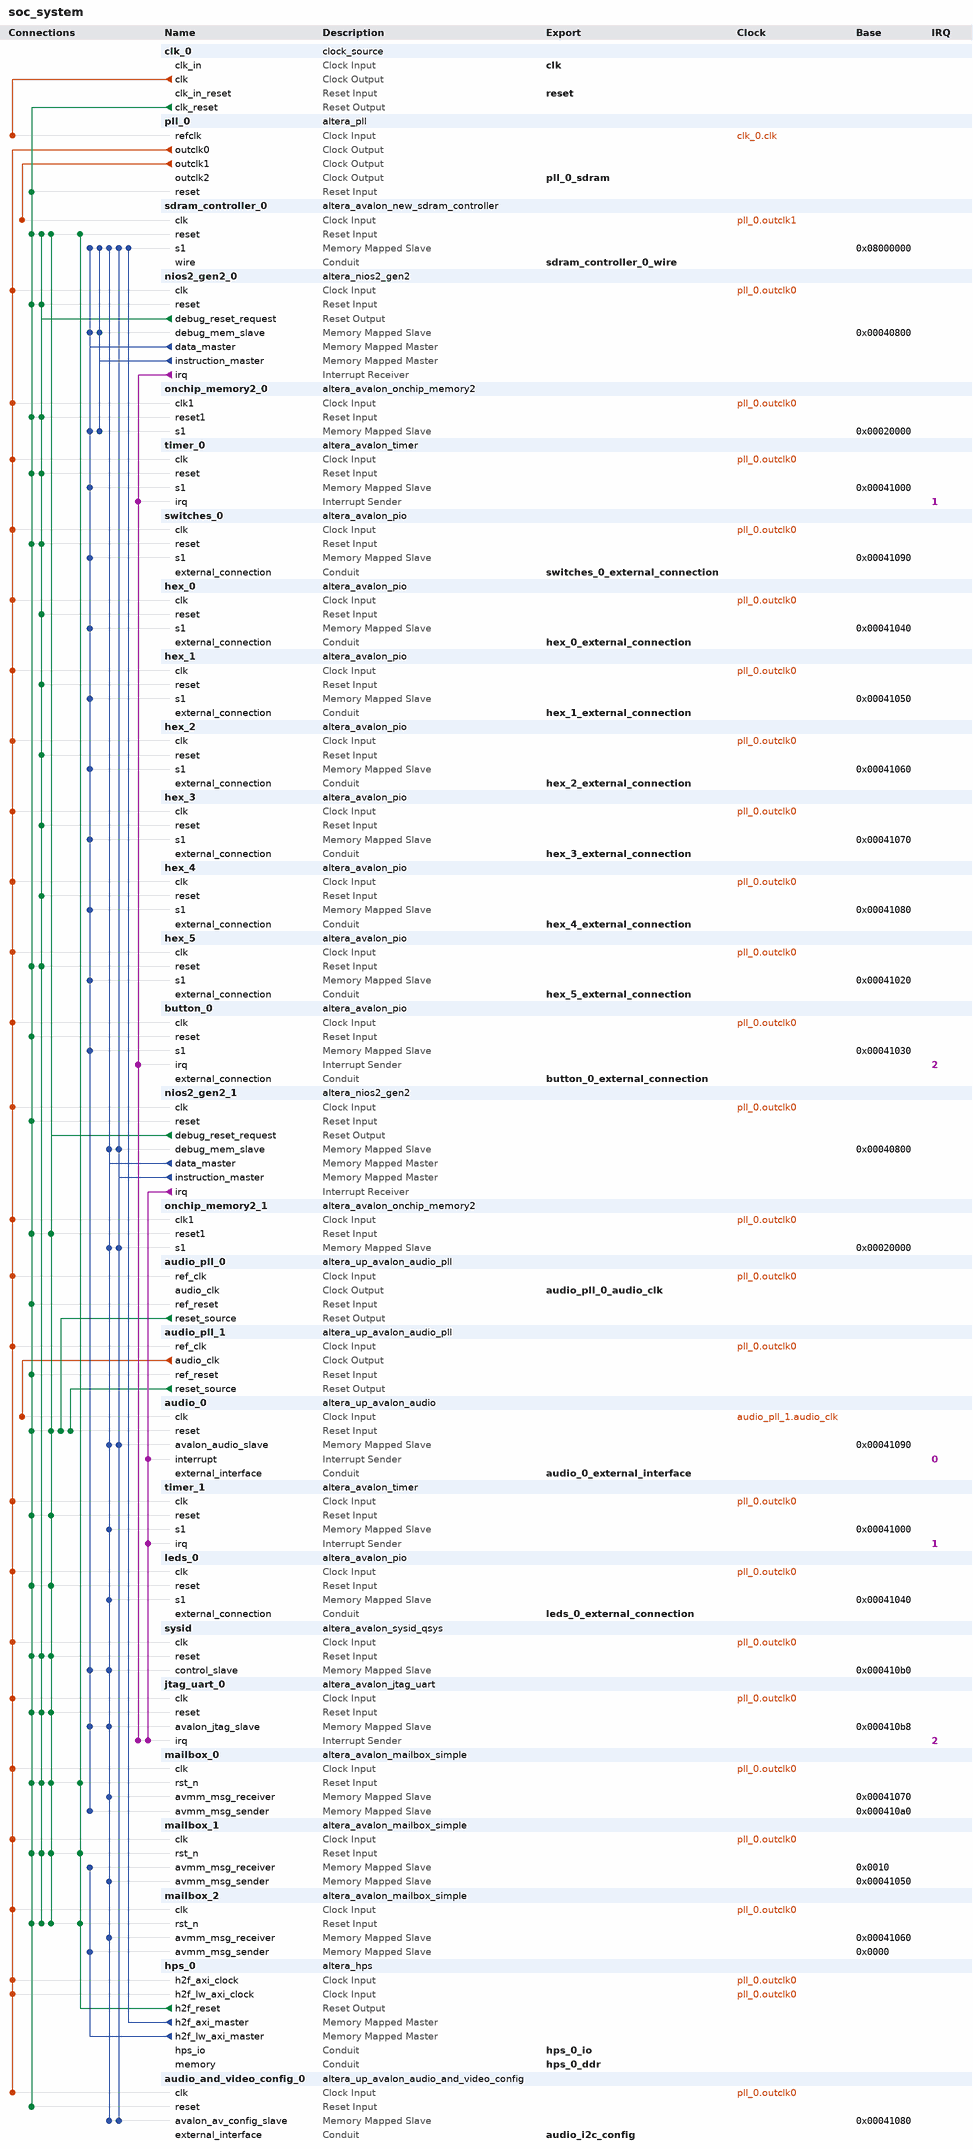
[diagram p0: system contents]
# Platform Designer (Qsys) system soc_system, Cyclone V 5CSEMA5F31C6
# Parameters at their usual value, and those the tool derives, are not listed.
package require -exact qsys 20.1
create_system soc_system
set_project_property DEVICE_FAMILY {Cyclone V}
set_project_property DEVICE 5CSEMA5F31C6

add_instance clk_0 clock_source 20.1
set_instance_parameter_value clk_0 clockFrequency 50000000

add_instance pll_0 altera_pll 20.1
set_instance_parameter_value pll_0 gui_device_speed_grade 1
set_instance_parameter_value pll_0 gui_number_of_clocks 3
set_instance_parameter_value pll_0 gui_operation_mode normal
set_instance_parameter_value pll_0 gui_output_clock_frequency0 50.0
set_instance_parameter_value pll_0 gui_output_clock_frequency1 100.0
set_instance_parameter_value pll_0 gui_output_clock_frequency2 100.0
set_instance_parameter_value pll_0 gui_phase_shift2 -3758
set_instance_parameter_value pll_0 gui_pll_mode {Integer-N PLL}
set_instance_parameter_value pll_0 gui_reference_clock_frequency 50.0
set_instance_parameter_value pll_0 gui_use_locked false

add_instance sdram_controller_0 altera_avalon_new_sdram_controller 20.1
set_instance_parameter_value sdram_controller_0 TAC 5.4
set_instance_parameter_value sdram_controller_0 TRCD 15.0
set_instance_parameter_value sdram_controller_0 TRP 15.0
set_instance_parameter_value sdram_controller_0 casLatency 3
set_instance_parameter_value sdram_controller_0 columnWidth 10
set_instance_parameter_value sdram_controller_0 dataWidth 16
set_instance_parameter_value sdram_controller_0 generateSimulationModel false
set_instance_parameter_value sdram_controller_0 model single_Micron_MT48LC4M32B2_7_chip
set_instance_parameter_value sdram_controller_0 numberOfBanks 4
set_instance_parameter_value sdram_controller_0 numberOfChipSelects 1
set_instance_parameter_value sdram_controller_0 powerUpDelay 100.0
set_instance_parameter_value sdram_controller_0 refreshPeriod 7.8125
set_instance_parameter_value sdram_controller_0 rowWidth 13

add_instance nios2_gen2_0 altera_nios2_gen2 20.1
set_instance_parameter_value nios2_gen2_0 dcache_size 2048
set_instance_parameter_value nios2_gen2_0 exceptionSlave sdram_controller_0.s1
set_instance_parameter_value nios2_gen2_0 icache_size 4096
set_instance_parameter_value nios2_gen2_0 impl Tiny
set_instance_parameter_value nios2_gen2_0 resetSlave onchip_memory2_0.s1

add_instance onchip_memory2_0 altera_avalon_onchip_memory2 20.1
set_instance_parameter_value onchip_memory2_0 dataWidth 256
set_instance_parameter_value onchip_memory2_0 dualPort false
set_instance_parameter_value onchip_memory2_0 initMemContent true
set_instance_parameter_value onchip_memory2_0 initializationFileName D:/Fax/projektovanje_namjenskih_racunarski_struktura/pnrs-2023/de1-soc-audio/sw/nios/app_0/de1_soc_user_input/mem_init/user_input_init.hex
set_instance_parameter_value onchip_memory2_0 memorySize 128000
set_instance_parameter_value onchip_memory2_0 useNonDefaultInitFile true
set_instance_parameter_value onchip_memory2_0 writable false

add_instance timer_0 altera_avalon_timer 20.1
set_instance_parameter_value timer_0 period 1
set_instance_parameter_value timer_0 periodUnits MSEC

add_instance switches_0 altera_avalon_pio 20.1
set_instance_parameter_value switches_0 direction Input
set_instance_parameter_value switches_0 width 10

add_instance hex_0 altera_avalon_pio 20.1
set_instance_parameter_value hex_0 direction Output
set_instance_parameter_value hex_0 resetValue 127
set_instance_parameter_value hex_0 width 7

add_instance hex_1 altera_avalon_pio 20.1
set_instance_parameter_value hex_1 direction Output
set_instance_parameter_value hex_1 resetValue 127
set_instance_parameter_value hex_1 width 7

add_instance hex_2 altera_avalon_pio 20.1
set_instance_parameter_value hex_2 direction Output
set_instance_parameter_value hex_2 resetValue 127
set_instance_parameter_value hex_2 width 7

add_instance hex_3 altera_avalon_pio 20.1
set_instance_parameter_value hex_3 direction Output
set_instance_parameter_value hex_3 resetValue 127
set_instance_parameter_value hex_3 width 7

add_instance hex_4 altera_avalon_pio 20.1
set_instance_parameter_value hex_4 direction Output
set_instance_parameter_value hex_4 resetValue 127
set_instance_parameter_value hex_4 width 7

add_instance hex_5 altera_avalon_pio 20.1
set_instance_parameter_value hex_5 direction Output
set_instance_parameter_value hex_5 resetValue 127
set_instance_parameter_value hex_5 width 7

add_instance button_0 altera_avalon_pio 20.1
set_instance_parameter_value button_0 captureEdge true
set_instance_parameter_value button_0 direction Input
set_instance_parameter_value button_0 edgeType FALLING
set_instance_parameter_value button_0 generateIRQ true
set_instance_parameter_value button_0 irqType EDGE
set_instance_parameter_value button_0 width 4

add_instance nios2_gen2_1 altera_nios2_gen2 20.1
set_instance_parameter_value nios2_gen2_1 cpuID 1
set_instance_parameter_value nios2_gen2_1 dcache_size 2048
set_instance_parameter_value nios2_gen2_1 exceptionOffset 1048608
set_instance_parameter_value nios2_gen2_1 exceptionSlave sdram_controller_0.s1
set_instance_parameter_value nios2_gen2_1 icache_size 4096
set_instance_parameter_value nios2_gen2_1 impl Tiny
set_instance_parameter_value nios2_gen2_1 resetSlave onchip_memory2_1.s1

add_instance onchip_memory2_1 altera_avalon_onchip_memory2 20.1
set_instance_parameter_value onchip_memory2_1 dataWidth 256
set_instance_parameter_value onchip_memory2_1 dualPort false
set_instance_parameter_value onchip_memory2_1 initMemContent true
set_instance_parameter_value onchip_memory2_1 initializationFileName D:/Fax/projektovanje_namjenskih_racunarski_struktura/pnrs-2023/de1-soc-audio/sw/nios/app_1/de1_soc_audio_processing/mem_init/audio_processing_init.hex
set_instance_parameter_value onchip_memory2_1 memorySize 128000
set_instance_parameter_value onchip_memory2_1 useNonDefaultInitFile true
set_instance_parameter_value onchip_memory2_1 writable false

add_instance audio_pll_0 altera_up_avalon_audio_pll 18.0
set_instance_parameter_value audio_pll_0 audio_clk_freq 18.432
set_instance_parameter_value audio_pll_0 gui_refclk 50.0

add_instance audio_pll_1 altera_up_avalon_audio_pll 18.0
set_instance_parameter_value audio_pll_1 audio_clk_freq 18.432
set_instance_parameter_value audio_pll_1 gui_refclk 50.0

add_instance audio_0 altera_up_avalon_audio 18.0
set_instance_parameter_value audio_0 audio_in true
set_instance_parameter_value audio_0 avalon_bus_type {Memory Mapped}
set_instance_parameter_value audio_0 dw 24

add_instance timer_1 altera_avalon_timer 20.1
set_instance_parameter_value timer_1 period 1
set_instance_parameter_value timer_1 periodUnits MSEC

add_instance leds_0 altera_avalon_pio 20.1
set_instance_parameter_value leds_0 direction Output
set_instance_parameter_value leds_0 width 10

add_instance sysid altera_avalon_sysid_qsys 20.1
set_instance_parameter_value sysid id 0

add_instance jtag_uart_0 altera_avalon_jtag_uart 20.1
set_instance_parameter_value jtag_uart_0 simInteractiveOptions NO_INTERACTIVE_WINDOWS

add_instance mailbox_0 altera_avalon_mailbox_simple 20.1
set_instance_parameter_value mailbox_0 AWIDTH 2
set_instance_parameter_value mailbox_0 DWIDTH 32
set_instance_parameter_value mailbox_0 MSG_ARRIVAL_NOTIFY 0
set_instance_parameter_value mailbox_0 MSG_SPACE_NOTIFY 0

add_instance mailbox_1 altera_avalon_mailbox_simple 20.1
set_instance_parameter_value mailbox_1 AWIDTH 2
set_instance_parameter_value mailbox_1 DWIDTH 32
set_instance_parameter_value mailbox_1 MSG_ARRIVAL_NOTIFY 0
set_instance_parameter_value mailbox_1 MSG_SPACE_NOTIFY 0

add_instance mailbox_2 altera_avalon_mailbox_simple 20.1
set_instance_parameter_value mailbox_2 AWIDTH 2
set_instance_parameter_value mailbox_2 DWIDTH 32
set_instance_parameter_value mailbox_2 MSG_ARRIVAL_NOTIFY 0
set_instance_parameter_value mailbox_2 MSG_SPACE_NOTIFY 0

add_instance hps_0 altera_hps 20.1
set_instance_parameter_value hps_0 EMAC1_Mode RGMII
set_instance_parameter_value hps_0 EMAC1_PinMuxing {HPS I/O Set 0}
set_instance_parameter_value hps_0 F2SCLK_COLDRST_Enable false
set_instance_parameter_value hps_0 F2SCLK_DBGRST_Enable false
set_instance_parameter_value hps_0 F2SCLK_WARMRST_Enable false
set_instance_parameter_value hps_0 F2SINTERRUPT_Enable false
set_instance_parameter_value hps_0 F2S_Width 0
set_instance_parameter_value hps_0 FPGA_PERIPHERAL_OUTPUT_CLOCK_FREQ_EMAC0_GTX_CLK 125
set_instance_parameter_value hps_0 FPGA_PERIPHERAL_OUTPUT_CLOCK_FREQ_EMAC0_MD_CLK 2.5
set_instance_parameter_value hps_0 FPGA_PERIPHERAL_OUTPUT_CLOCK_FREQ_EMAC1_GTX_CLK 125
set_instance_parameter_value hps_0 FPGA_PERIPHERAL_OUTPUT_CLOCK_FREQ_EMAC1_MD_CLK 2.5
set_instance_parameter_value hps_0 HPS_PROTOCOL DDR3
set_instance_parameter_value hps_0 I2C0_Mode I2C
set_instance_parameter_value hps_0 I2C0_PinMuxing {HPS I/O Set 0}
set_instance_parameter_value hps_0 I2C1_Mode N/A
set_instance_parameter_value hps_0 I2C1_PinMuxing Unused
set_instance_parameter_value hps_0 LWH2F_Enable true
set_instance_parameter_value hps_0 MEM_BANKADDR_WIDTH 3
set_instance_parameter_value hps_0 MEM_CLK_FREQ 400.0
set_instance_parameter_value hps_0 MEM_COL_ADDR_WIDTH 10
set_instance_parameter_value hps_0 MEM_DQ_WIDTH 32
set_instance_parameter_value hps_0 MEM_DRV_STR RZQ/7
set_instance_parameter_value hps_0 MEM_ROW_ADDR_WIDTH 15
set_instance_parameter_value hps_0 MEM_RTT_NOM RZQ/4
set_instance_parameter_value hps_0 MEM_RTT_WR RZQ/4
set_instance_parameter_value hps_0 MEM_TCL 11
set_instance_parameter_value hps_0 MEM_TFAW_NS 30.0
set_instance_parameter_value hps_0 MEM_TRAS_NS 35.0
set_instance_parameter_value hps_0 MEM_TRCD_NS 13.75
set_instance_parameter_value hps_0 MEM_TRFC_NS 260.0
set_instance_parameter_value hps_0 MEM_TRP_NS 13.75
set_instance_parameter_value hps_0 MEM_VENDOR Other
set_instance_parameter_value hps_0 MEM_WTCL 8
set_instance_parameter_value hps_0 QSPI_Mode N/A
set_instance_parameter_value hps_0 QSPI_PinMuxing Unused
set_instance_parameter_value hps_0 REF_CLK_FREQ 25.0
set_instance_parameter_value hps_0 S2FCLK_USER2CLK 5
set_instance_parameter_value hps_0 S2F_Width 1
set_instance_parameter_value hps_0 SDIO_Mode {4-bit Data}
set_instance_parameter_value hps_0 SDIO_PinMuxing {HPS I/O Set 0}
set_instance_parameter_value hps_0 SPIM1_Mode N/A
set_instance_parameter_value hps_0 SPIM1_PinMuxing Unused
set_instance_parameter_value hps_0 STM_Enable false
set_instance_parameter_value hps_0 TIMING_BOARD_AC_SKEW 0.02
set_instance_parameter_value hps_0 TIMING_BOARD_AC_TO_CK_SKEW 0.01
set_instance_parameter_value hps_0 TIMING_BOARD_DQ_TO_DQS_SKEW 0.05
set_instance_parameter_value hps_0 TIMING_BOARD_MAX_CK_DELAY 0.03
set_instance_parameter_value hps_0 TIMING_BOARD_MAX_DQS_DELAY 0.02
set_instance_parameter_value hps_0 TIMING_BOARD_SKEW_BETWEEN_DQS 0.06
set_instance_parameter_value hps_0 TIMING_BOARD_SKEW_CKDQS_DIMM_MAX 0.12
set_instance_parameter_value hps_0 TIMING_BOARD_SKEW_CKDQS_DIMM_MIN 0.06
set_instance_parameter_value hps_0 TIMING_BOARD_SKEW_WITHIN_DQS 0.01
set_instance_parameter_value hps_0 TIMING_TDH 65
set_instance_parameter_value hps_0 TIMING_TDQSCK 255
set_instance_parameter_value hps_0 TIMING_TDQSQ 125
set_instance_parameter_value hps_0 TIMING_TDS 30
set_instance_parameter_value hps_0 TIMING_TIH 140
set_instance_parameter_value hps_0 TIMING_TIS 180
set_instance_parameter_value hps_0 TIMING_TQSH 0.4
set_instance_parameter_value hps_0 UART0_Mode {No Flow Control}
set_instance_parameter_value hps_0 UART0_PinMuxing {HPS I/O Set 0}
set_instance_parameter_value hps_0 USB1_Mode N/A
set_instance_parameter_value hps_0 USB1_PinMuxing Unused
set_instance_parameter_value hps_0 desired_cfg_clk_mhz 100.0
set_instance_parameter_value hps_0 desired_qspi_clk_mhz 400.0

add_instance audio_and_video_config_0 altera_up_avalon_audio_and_video_config 18.0
set_instance_parameter_value audio_and_video_config_0 audio_in {Microphone to ADC}
set_instance_parameter_value audio_and_video_config_0 bit_length 24
set_instance_parameter_value audio_and_video_config_0 board DE1-SoC
set_instance_parameter_value audio_and_video_config_0 data_format {I2S Format}
set_instance_parameter_value audio_and_video_config_0 line_in_bypass false
set_instance_parameter_value audio_and_video_config_0 sampling_rate {48 kHz}

# connections
add_connection audio_pll_1.audio_clk audio_0.clk clock
add_connection clk_0.clk pll_0.refclk clock
add_connection pll_0.outclk0 audio_and_video_config_0.clk clock
add_connection pll_0.outclk0 audio_pll_0.ref_clk clock
add_connection pll_0.outclk0 audio_pll_1.ref_clk clock
add_connection pll_0.outclk0 button_0.clk clock
add_connection pll_0.outclk0 hex_0.clk clock
add_connection pll_0.outclk0 hex_1.clk clock
add_connection pll_0.outclk0 hex_2.clk clock
add_connection pll_0.outclk0 hex_3.clk clock
add_connection pll_0.outclk0 hex_4.clk clock
add_connection pll_0.outclk0 hex_5.clk clock
add_connection pll_0.outclk0 hps_0.h2f_axi_clock clock
add_connection pll_0.outclk0 hps_0.h2f_lw_axi_clock clock
add_connection pll_0.outclk0 jtag_uart_0.clk clock
add_connection pll_0.outclk0 leds_0.clk clock
add_connection pll_0.outclk0 mailbox_0.clk clock
add_connection pll_0.outclk0 mailbox_1.clk clock
add_connection pll_0.outclk0 mailbox_2.clk clock
add_connection pll_0.outclk0 nios2_gen2_0.clk clock
add_connection pll_0.outclk0 nios2_gen2_1.clk clock
add_connection pll_0.outclk0 onchip_memory2_0.clk1 clock
add_connection pll_0.outclk0 onchip_memory2_1.clk1 clock
add_connection pll_0.outclk0 switches_0.clk clock
add_connection pll_0.outclk0 sysid.clk clock
add_connection pll_0.outclk0 timer_0.clk clock
add_connection pll_0.outclk0 timer_1.clk clock
add_connection pll_0.outclk1 sdram_controller_0.clk clock
add_connection audio_pll_0.reset_source audio_0.reset reset
add_connection audio_pll_1.reset_source audio_0.reset reset
add_connection clk_0.clk_reset audio_0.reset reset
add_connection clk_0.clk_reset audio_and_video_config_0.reset reset
add_connection clk_0.clk_reset audio_pll_0.ref_reset reset
add_connection clk_0.clk_reset audio_pll_1.ref_reset reset
add_connection clk_0.clk_reset button_0.reset reset
add_connection clk_0.clk_reset hex_5.reset reset
add_connection clk_0.clk_reset jtag_uart_0.reset reset
add_connection clk_0.clk_reset leds_0.reset reset
add_connection clk_0.clk_reset mailbox_0.rst_n reset
add_connection clk_0.clk_reset mailbox_1.rst_n reset
add_connection clk_0.clk_reset mailbox_2.rst_n reset
add_connection clk_0.clk_reset nios2_gen2_0.reset reset
add_connection clk_0.clk_reset nios2_gen2_1.reset reset
add_connection clk_0.clk_reset onchip_memory2_0.reset1 reset
add_connection clk_0.clk_reset onchip_memory2_1.reset1 reset
add_connection clk_0.clk_reset pll_0.reset reset
add_connection clk_0.clk_reset sdram_controller_0.reset reset
add_connection clk_0.clk_reset switches_0.reset reset
add_connection clk_0.clk_reset sysid.reset reset
add_connection clk_0.clk_reset timer_0.reset reset
add_connection clk_0.clk_reset timer_1.reset reset
add_connection hps_0.h2f_reset mailbox_0.rst_n reset
add_connection hps_0.h2f_reset mailbox_1.rst_n reset
add_connection hps_0.h2f_reset mailbox_2.rst_n reset
add_connection hps_0.h2f_reset sdram_controller_0.reset reset
add_connection nios2_gen2_0.debug_reset_request hex_0.reset reset
add_connection nios2_gen2_0.debug_reset_request hex_1.reset reset
add_connection nios2_gen2_0.debug_reset_request hex_2.reset reset
add_connection nios2_gen2_0.debug_reset_request hex_3.reset reset
add_connection nios2_gen2_0.debug_reset_request hex_4.reset reset
add_connection nios2_gen2_0.debug_reset_request hex_5.reset reset
add_connection nios2_gen2_0.debug_reset_request jtag_uart_0.reset reset
add_connection nios2_gen2_0.debug_reset_request mailbox_0.rst_n reset
add_connection nios2_gen2_0.debug_reset_request mailbox_1.rst_n reset
add_connection nios2_gen2_0.debug_reset_request mailbox_2.rst_n reset
add_connection nios2_gen2_0.debug_reset_request nios2_gen2_0.reset reset
add_connection nios2_gen2_0.debug_reset_request onchip_memory2_0.reset1 reset
add_connection nios2_gen2_0.debug_reset_request sdram_controller_0.reset reset
add_connection nios2_gen2_0.debug_reset_request switches_0.reset reset
add_connection nios2_gen2_0.debug_reset_request sysid.reset reset
add_connection nios2_gen2_0.debug_reset_request timer_0.reset reset
add_connection nios2_gen2_1.debug_reset_request audio_0.reset reset
add_connection nios2_gen2_1.debug_reset_request jtag_uart_0.reset reset
add_connection nios2_gen2_1.debug_reset_request leds_0.reset reset
add_connection nios2_gen2_1.debug_reset_request mailbox_0.rst_n reset
add_connection nios2_gen2_1.debug_reset_request mailbox_1.rst_n reset
add_connection nios2_gen2_1.debug_reset_request mailbox_2.rst_n reset
add_connection nios2_gen2_1.debug_reset_request onchip_memory2_1.reset1 reset
add_connection nios2_gen2_1.debug_reset_request sdram_controller_0.reset reset
add_connection nios2_gen2_1.debug_reset_request sysid.reset reset
add_connection nios2_gen2_1.debug_reset_request timer_1.reset reset
add_connection hps_0.h2f_axi_master sdram_controller_0.s1 avalon
set_connection_parameter_value hps_0.h2f_axi_master/sdram_controller_0.s1 baseAddress 0x08000000
add_connection hps_0.h2f_lw_axi_master mailbox_1.avmm_msg_receiver avalon
set_connection_parameter_value hps_0.h2f_lw_axi_master/mailbox_1.avmm_msg_receiver baseAddress 0x0010
add_connection hps_0.h2f_lw_axi_master mailbox_2.avmm_msg_sender avalon
set_connection_parameter_value hps_0.h2f_lw_axi_master/mailbox_2.avmm_msg_sender baseAddress 0x0000
add_connection nios2_gen2_0.data_master button_0.s1 avalon
set_connection_parameter_value nios2_gen2_0.data_master/button_0.s1 baseAddress 0x00041030
add_connection nios2_gen2_0.data_master hex_0.s1 avalon
set_connection_parameter_value nios2_gen2_0.data_master/hex_0.s1 baseAddress 0x00041040
add_connection nios2_gen2_0.data_master hex_1.s1 avalon
set_connection_parameter_value nios2_gen2_0.data_master/hex_1.s1 baseAddress 0x00041050
add_connection nios2_gen2_0.data_master hex_2.s1 avalon
set_connection_parameter_value nios2_gen2_0.data_master/hex_2.s1 baseAddress 0x00041060
add_connection nios2_gen2_0.data_master hex_3.s1 avalon
set_connection_parameter_value nios2_gen2_0.data_master/hex_3.s1 baseAddress 0x00041070
add_connection nios2_gen2_0.data_master hex_4.s1 avalon
set_connection_parameter_value nios2_gen2_0.data_master/hex_4.s1 baseAddress 0x00041080
add_connection nios2_gen2_0.data_master hex_5.s1 avalon
set_connection_parameter_value nios2_gen2_0.data_master/hex_5.s1 baseAddress 0x00041020
add_connection nios2_gen2_0.data_master jtag_uart_0.avalon_jtag_slave avalon
set_connection_parameter_value nios2_gen2_0.data_master/jtag_uart_0.avalon_jtag_slave baseAddress 0x000410b8
add_connection nios2_gen2_0.data_master mailbox_0.avmm_msg_sender avalon
set_connection_parameter_value nios2_gen2_0.data_master/mailbox_0.avmm_msg_sender baseAddress 0x000410a0
add_connection nios2_gen2_0.data_master nios2_gen2_0.debug_mem_slave avalon
set_connection_parameter_value nios2_gen2_0.data_master/nios2_gen2_0.debug_mem_slave baseAddress 0x00040800
add_connection nios2_gen2_0.data_master onchip_memory2_0.s1 avalon
set_connection_parameter_value nios2_gen2_0.data_master/onchip_memory2_0.s1 baseAddress 0x00020000
add_connection nios2_gen2_0.data_master sdram_controller_0.s1 avalon
set_connection_parameter_value nios2_gen2_0.data_master/sdram_controller_0.s1 baseAddress 0x08000000
add_connection nios2_gen2_0.data_master switches_0.s1 avalon
set_connection_parameter_value nios2_gen2_0.data_master/switches_0.s1 baseAddress 0x00041090
add_connection nios2_gen2_0.data_master sysid.control_slave avalon
set_connection_parameter_value nios2_gen2_0.data_master/sysid.control_slave baseAddress 0x000410b0
add_connection nios2_gen2_0.data_master timer_0.s1 avalon
set_connection_parameter_value nios2_gen2_0.data_master/timer_0.s1 baseAddress 0x00041000
add_connection nios2_gen2_0.instruction_master nios2_gen2_0.debug_mem_slave avalon
set_connection_parameter_value nios2_gen2_0.instruction_master/nios2_gen2_0.debug_mem_slave baseAddress 0x00040800
add_connection nios2_gen2_0.instruction_master onchip_memory2_0.s1 avalon
set_connection_parameter_value nios2_gen2_0.instruction_master/onchip_memory2_0.s1 baseAddress 0x00020000
add_connection nios2_gen2_0.instruction_master sdram_controller_0.s1 avalon
set_connection_parameter_value nios2_gen2_0.instruction_master/sdram_controller_0.s1 baseAddress 0x08000000
add_connection nios2_gen2_1.data_master audio_0.avalon_audio_slave avalon
set_connection_parameter_value nios2_gen2_1.data_master/audio_0.avalon_audio_slave baseAddress 0x00041090
add_connection nios2_gen2_1.data_master audio_and_video_config_0.avalon_av_config_slave avalon
set_connection_parameter_value nios2_gen2_1.data_master/audio_and_video_config_0.avalon_av_config_slave baseAddress 0x00041080
add_connection nios2_gen2_1.data_master jtag_uart_0.avalon_jtag_slave avalon
set_connection_parameter_value nios2_gen2_1.data_master/jtag_uart_0.avalon_jtag_slave baseAddress 0x000410b8
add_connection nios2_gen2_1.data_master leds_0.s1 avalon
set_connection_parameter_value nios2_gen2_1.data_master/leds_0.s1 baseAddress 0x00041040
add_connection nios2_gen2_1.data_master mailbox_0.avmm_msg_receiver avalon
set_connection_parameter_value nios2_gen2_1.data_master/mailbox_0.avmm_msg_receiver baseAddress 0x00041070
add_connection nios2_gen2_1.data_master mailbox_1.avmm_msg_sender avalon
set_connection_parameter_value nios2_gen2_1.data_master/mailbox_1.avmm_msg_sender baseAddress 0x00041050
add_connection nios2_gen2_1.data_master mailbox_2.avmm_msg_receiver avalon
set_connection_parameter_value nios2_gen2_1.data_master/mailbox_2.avmm_msg_receiver baseAddress 0x00041060
add_connection nios2_gen2_1.data_master nios2_gen2_1.debug_mem_slave avalon
set_connection_parameter_value nios2_gen2_1.data_master/nios2_gen2_1.debug_mem_slave baseAddress 0x00040800
add_connection nios2_gen2_1.data_master onchip_memory2_1.s1 avalon
set_connection_parameter_value nios2_gen2_1.data_master/onchip_memory2_1.s1 baseAddress 0x00020000
add_connection nios2_gen2_1.data_master sdram_controller_0.s1 avalon
set_connection_parameter_value nios2_gen2_1.data_master/sdram_controller_0.s1 baseAddress 0x08000000
add_connection nios2_gen2_1.data_master sysid.control_slave avalon
set_connection_parameter_value nios2_gen2_1.data_master/sysid.control_slave baseAddress 0x000410b0
add_connection nios2_gen2_1.data_master timer_1.s1 avalon
set_connection_parameter_value nios2_gen2_1.data_master/timer_1.s1 baseAddress 0x00041000
add_connection nios2_gen2_1.instruction_master audio_0.avalon_audio_slave avalon
set_connection_parameter_value nios2_gen2_1.instruction_master/audio_0.avalon_audio_slave baseAddress 0x00041090
add_connection nios2_gen2_1.instruction_master audio_and_video_config_0.avalon_av_config_slave avalon
set_connection_parameter_value nios2_gen2_1.instruction_master/audio_and_video_config_0.avalon_av_config_slave baseAddress 0x00041080
add_connection nios2_gen2_1.instruction_master nios2_gen2_1.debug_mem_slave avalon
set_connection_parameter_value nios2_gen2_1.instruction_master/nios2_gen2_1.debug_mem_slave baseAddress 0x00040800
add_connection nios2_gen2_1.instruction_master onchip_memory2_1.s1 avalon
set_connection_parameter_value nios2_gen2_1.instruction_master/onchip_memory2_1.s1 baseAddress 0x00020000
add_connection nios2_gen2_1.instruction_master sdram_controller_0.s1 avalon
set_connection_parameter_value nios2_gen2_1.instruction_master/sdram_controller_0.s1 baseAddress 0x08000000
add_connection nios2_gen2_0.irq button_0.irq interrupt
set_connection_parameter_value nios2_gen2_0.irq/button_0.irq irqNumber 2
add_connection nios2_gen2_0.irq jtag_uart_0.irq interrupt
set_connection_parameter_value nios2_gen2_0.irq/jtag_uart_0.irq irqNumber 0
add_connection nios2_gen2_0.irq timer_0.irq interrupt
set_connection_parameter_value nios2_gen2_0.irq/timer_0.irq irqNumber 1
add_connection nios2_gen2_1.irq audio_0.interrupt interrupt
set_connection_parameter_value nios2_gen2_1.irq/audio_0.interrupt irqNumber 0
add_connection nios2_gen2_1.irq jtag_uart_0.irq interrupt
set_connection_parameter_value nios2_gen2_1.irq/jtag_uart_0.irq irqNumber 2
add_connection nios2_gen2_1.irq timer_1.irq interrupt
set_connection_parameter_value nios2_gen2_1.irq/timer_1.irq irqNumber 1

# exported interfaces
add_interface audio_0_external_interface conduit end
set_interface_property audio_0_external_interface EXPORT_OF audio_0.external_interface
add_interface audio_i2c_config conduit end
set_interface_property audio_i2c_config EXPORT_OF audio_and_video_config_0.external_interface
add_interface audio_pll_0_audio_clk clock source
set_interface_property audio_pll_0_audio_clk EXPORT_OF audio_pll_0.audio_clk
add_interface button_0_external_connection conduit end
set_interface_property button_0_external_connection EXPORT_OF button_0.external_connection
add_interface clk clock sink
set_interface_property clk EXPORT_OF clk_0.clk_in
add_interface hex_0_external_connection conduit end
set_interface_property hex_0_external_connection EXPORT_OF hex_0.external_connection
add_interface hex_1_external_connection conduit end
set_interface_property hex_1_external_connection EXPORT_OF hex_1.external_connection
add_interface hex_2_external_connection conduit end
set_interface_property hex_2_external_connection EXPORT_OF hex_2.external_connection
add_interface hex_3_external_connection conduit end
set_interface_property hex_3_external_connection EXPORT_OF hex_3.external_connection
add_interface hex_4_external_connection conduit end
set_interface_property hex_4_external_connection EXPORT_OF hex_4.external_connection
add_interface hex_5_external_connection conduit end
set_interface_property hex_5_external_connection EXPORT_OF hex_5.external_connection
add_interface hps_0_ddr conduit end
set_interface_property hps_0_ddr EXPORT_OF hps_0.memory
add_interface hps_0_io conduit end
set_interface_property hps_0_io EXPORT_OF hps_0.hps_io
add_interface leds_0_external_connection conduit end
set_interface_property leds_0_external_connection EXPORT_OF leds_0.external_connection
add_interface pll_0_sdram clock source
set_interface_property pll_0_sdram EXPORT_OF pll_0.outclk2
add_interface reset reset sink
set_interface_property reset EXPORT_OF clk_0.clk_in_reset
add_interface sdram_controller_0_wire conduit end
set_interface_property sdram_controller_0_wire EXPORT_OF sdram_controller_0.wire
add_interface switches_0_external_connection conduit end
set_interface_property switches_0_external_connection EXPORT_OF switches_0.external_connection

set_interconnect_requirement {$system} qsys_mm.clockCrossingAdapter HANDSHAKE
set_interconnect_requirement {$system} qsys_mm.enableEccProtection FALSE
set_interconnect_requirement {$system} qsys_mm.insertDefaultSlave FALSE
set_interconnect_requirement {$system} qsys_mm.maxAdditionalLatency 1

save_system soc_system.qsys
